# Altium project WiFi_SerialPassThroughModule.PrjPcb
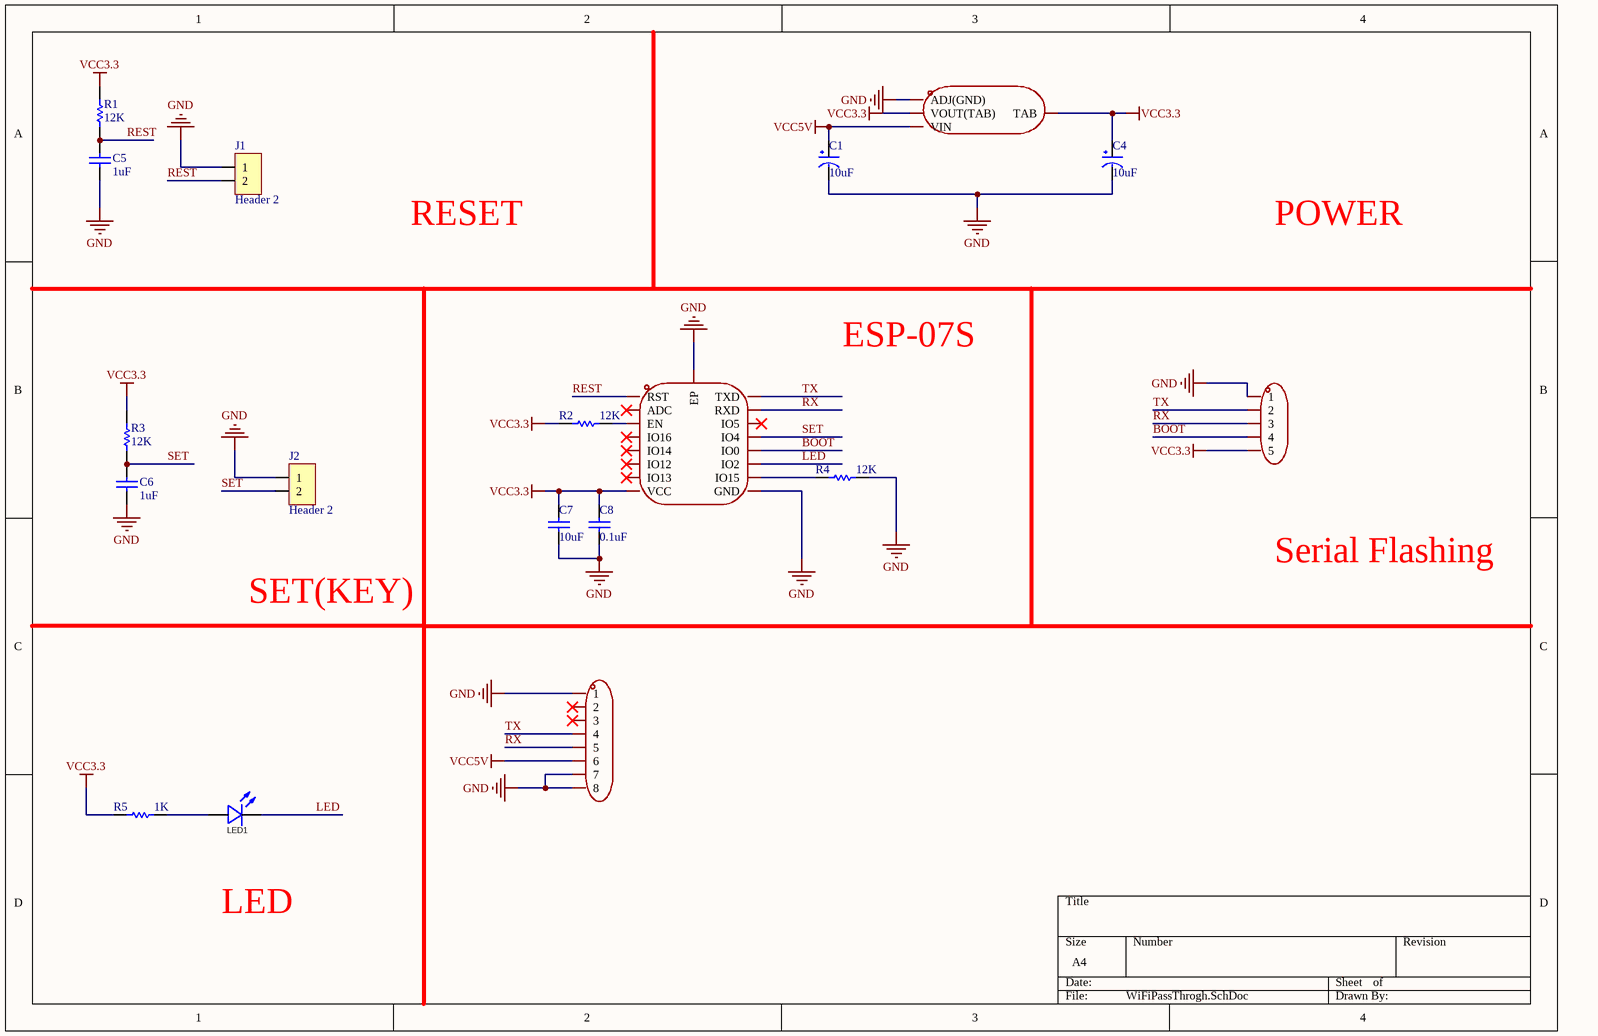
[diagram p0: WiFiPassThrogh.SchDoc]
1 sheet, 18 parts. Net scope: global (net labels, ports and power ports of the same name join across sheets).
Board file: WiFiPassThrough.PcbDoc

## Sheet WiFiPassThrogh.SchDoc
size A4; SheetNumber: 1; SheetTotal: 1

### Parts
C1  10uF  [CAP-SMD_L3.2-W1.6-RD-C7171]
C4  10uF  [CAP-SMD_L3.2-W1.6-RD-C7171]
C5  1uF  [C0805]
C6  1uF  [C0805]
C7  10uF  [C0805]
C8  0.1uF  [C0805]
CON1  HC-1.25-6PWT  [CONN-SMD_6P-P1.25_HC-1.25-6PWT]  (value not drawn)
J1  Header 2  [HDR-TH_2P-P2.54-V-M]
J2  Header 2  [HDR-TH_2P-P2.54-V-M]
J3  PZ254V-11-05P  [HDR-TH_5P-P2.54-V-M]  (value not drawn)
LED1  NCD0805R1  [LED0805-R-RD]  (value not drawn)
R1  12K  [R0805]
R2  12K  [R0805]
R3  12K  [R0805]
R4  12K  [R0805]
R5  1K  [R0805]
U1  AMS1117-3.3  [AMS1117-SOT-223-4]  (value not drawn)
U2  ESP-07S  [WIRELM-SMD_ESP-07S]  (value not drawn)

### Nets
GND: C1.2(GND) C4.2(GND) C5.1 C6.1 C7.1 C8.1 CON1.1 CON1.7 CON1.8 J1.1 J2.1 J3.1 R4.2 U1.1(ADJ(GND)) U2.9(GND) U2.17(EP)
VCC3.3: C4.1(VCC) C7.2 C8.2 J3.5 R1.2 R2.1 R3.2 R5.2 U1.2(VOUT(TAB)) U1.4(TAB) U2.8(VCC)
VCC5V: C1.1(VCC) CON1.6 U1.3(VIN)
BOOT: J3.4 U2.12(IO0)
LED: LED1.2(-) U2.11(IO2)
REST: C5.2 J1.2 R1.1 U2.1(RST)
RX: CON1.5 J3.3 U2.15(RXD)
SET: C6.2 J2.2 R3.1 U2.13(IO4)
TX: CON1.4 J3.2 U2.16(TXD)
NetLED1_1: LED1.1(+) R5.1
NetR2_2: R2.2 U2.3(EN)
NetR4_1: R4.1 U2.10(IO15)

Not connected (* = marked no-connect by the designer): CON1 2* 3*; U2 2(ADC)* 4(IO16)* 5(IO14)* 6(IO12)* 7(IO13)* 14(IO5)*

### Notes on the sheet
- RESET
- POWER
- ESP-07S
- Serial Flashing
- SET(KEY)
- LED

### Library data of the parts
C1 C4 = Cap Pol: 极性电容
C5-C8 = Cap: 电容; Published: 8-Jun-2000; LatestRevisionDate: 17-Jul-2002; LatestRevisionNote: Re-released for DXP Platform.; PackageReference: RAD-0.3; Publisher: Altium Limited; PackageDescription: Radial Cap, Thru-Hole; 2 Leads; 0.3 in Pin Spacing; UnitPrice: 0.02
CON1 = HC-1.25-6PWT: Manufacturer: HCTL(华灿天禄); Add into BOM: yes; Pins Structure: 1x6P; Pitch: 1.25mm; Number of PINs Per Row: 6; Current Rating (Max): 2A; Symbol: HC-1.25-6PWT; Device: HC-1.25-6PWT; LCSC Part Name: 1x6P 间距:1.25mm 卧贴; Supplier Part: C2845383; Manufacturer Part: HC-1.25-6PWT; Supplier Footprint: SMD,P=1.25mm,卧贴; JLCPCB Part Class: Extended Part; Datasheet: https://atta.szlcsc.com/upload/public/pdf/source/20230707/D26CCCA63A4ED0B68E63A615510D7FF9.pdf; Supplier: LCSC; Convert to PCB: yes; Mounting Style: 卧贴; Reference Series: -; Number of Pins: 6P; Number of Rows: 1; Row Spacing: -; Contact Material: 黄铜; Contact Plating: 锡; Operating Temperature Range: -25℃~+85℃
J1 J2 = Header 2: Header, 2-Pin; LatestRevisionDate: 17-Jul-2002; LatestRevisionNote: Re-released for DXP Platform.; Publisher: Altium Limited
J3 = Header 5: Manufacturer: XFCN(兴飞); Add into BOM: yes; Pin Structure: 1x5P; Pitch: 2.54mm; Circluar Pins/Square Pins: 方针; Symbol: PZ254V-11-05P; Device: PZ254V-11-05P; LCSC Part Name: 间距:2.54mm 1x5P 直插 方针; Supplier Part: C492404; Manufacturer Part: PZ254V-11-05P; Supplier Footprint: 插件,P=2.54mm; JLCPCB Part Class: Extended Part; Datasheet: https://atta.szlcsc.com/upload/public/pdf/source/20200309/C492404_E51533260F8710EFF5D4617281164C1D.pdf; Supplier: LCSC; Convert to PCB: yes; Row Spacing: -; Mounting Type: 直插; Number of Rows: 单排; Number of Pins: 5P; Current Rating (Max): -; Voltage Rating (Max): -; Length of Mating Pin: 6mm; Insulation Height: 2.5mm; Length of End Connection Pin: 3mm; Contact Material: 黄铜; Contact Plating: -; Operating Temperature Range: -40℃~+105℃; Color: 黑色
LED1 = LED0805R1: Manufacturer: 国星光电; Symbol: FC-2012HRK-620D; Add into BOM: yes; Emitted Color: 红色; Forward Voltage (VF): 1.6V~2.6V; Power Dissipation: 65mW; Forward Current: 20mA; Dominant Wavelength: 615nm~630nm; Diode Configuration: 独立二极管; Lens Color: 无色透明透镜; Luminous Intensity: 67mcd~195mcd; Viewing Angle: 130°; Device: NCD0805R1; LCSC Part Name: NCD0805R1; Supplier Part: C84256; Manufacturer Part: NCD0805R1; Supplier Footprint: 0805; JLCPCB Part Class: Basic Part; Datasheet: https://atta.szlcsc.com/upload/public/pdf/source/20200820/C84256_F0A75A43B3EAD75808600A0514C76B99.pdf; Supplier: LCSC; Convert to PCB: yes; Lamp Holder Type: -; Peak Wavelength: -; Color Temperature: -; Mounting Sytle: -; Operating Temperature: -30℃~+85℃
R1-R5 = Res1: 电阻; Published: 8-Jun-2000; LatestRevisionDate: 17-Jul-2002; LatestRevisionNote: Re-released for DXP Platform.; PackageReference: AXIAL-0.3; Publisher: Altium Limited; PackageDescription: Axial Device, Thru-Hole; 2 Leads; 0.3 in Pin Spacing
U1 = AMS1117-3.3_C347222: Manufacturer: UMW(友台半导体); Add into BOM: yes; Output Type: 固定; Maximum Input Voltage: 12V; Output Voltage: 3.3V; MAX Output Current: 1A; Power Supply Rejection Ratio (PSRR): 60dB@(120Hz); Dropout Voltage: 1.3V@(1A); Output Polarity: 正极; Number of Outputs: 1; Symbol: AMS1117-3.3_C347222; Device: AMS1117-3.3_C347222; LCSC Part Name: 输出:3.3V 电流:1A 耐压:12V; Supplier Part: C347222; Manufacturer Part: AMS1117-3.3; Supplier Footprint: SOT-223; JLCPCB Part Class: Extended Part; Datasheet: https://atta.szlcsc.com/upload/public/pdf/source/20231109/155D79A26D9DB04352555A58D5969DC8.pdf; Supplier: LCSC; Convert to PCB: yes; standby current: -; Noise: -; Feature: -; Operating Temperature: -
U2 = ESP-07S: ESP8266-07S; Manufacturer: Ai-Thinker(安信可); Device: ESP-07S_C82895; Add into BOM: yes; Core Processor: ESP8266芯片; Support Interface: I2C；HSPI；UART；I2S; Value: 2.4GHz; Antenna Type: 板载PCB天线; Output Power: 19.5dBm; Operating Voltage: 3.3V; Sensitivity: -98dBm; Symbol: ESP-07S; LCSC Part Name: 802.11b/g/n模块; Supplier Part: C82895; Manufacturer Part: ESP-07S; Supplier Footprint: SMD,16x17mm; JLCPCB Part Class: Extended Part; Datasheet: https://atta.szlcsc.com/upload/public/pdf/source/20161024/1477288471743.pdf; Supplier: LCSC; Convert to PCB: yes; Wireless Standard: -; Receive  Current: -; Send  Current: -; Operating Temperature: -40℃~+125℃